# Altium project PCB_Libelula.PrjPcb
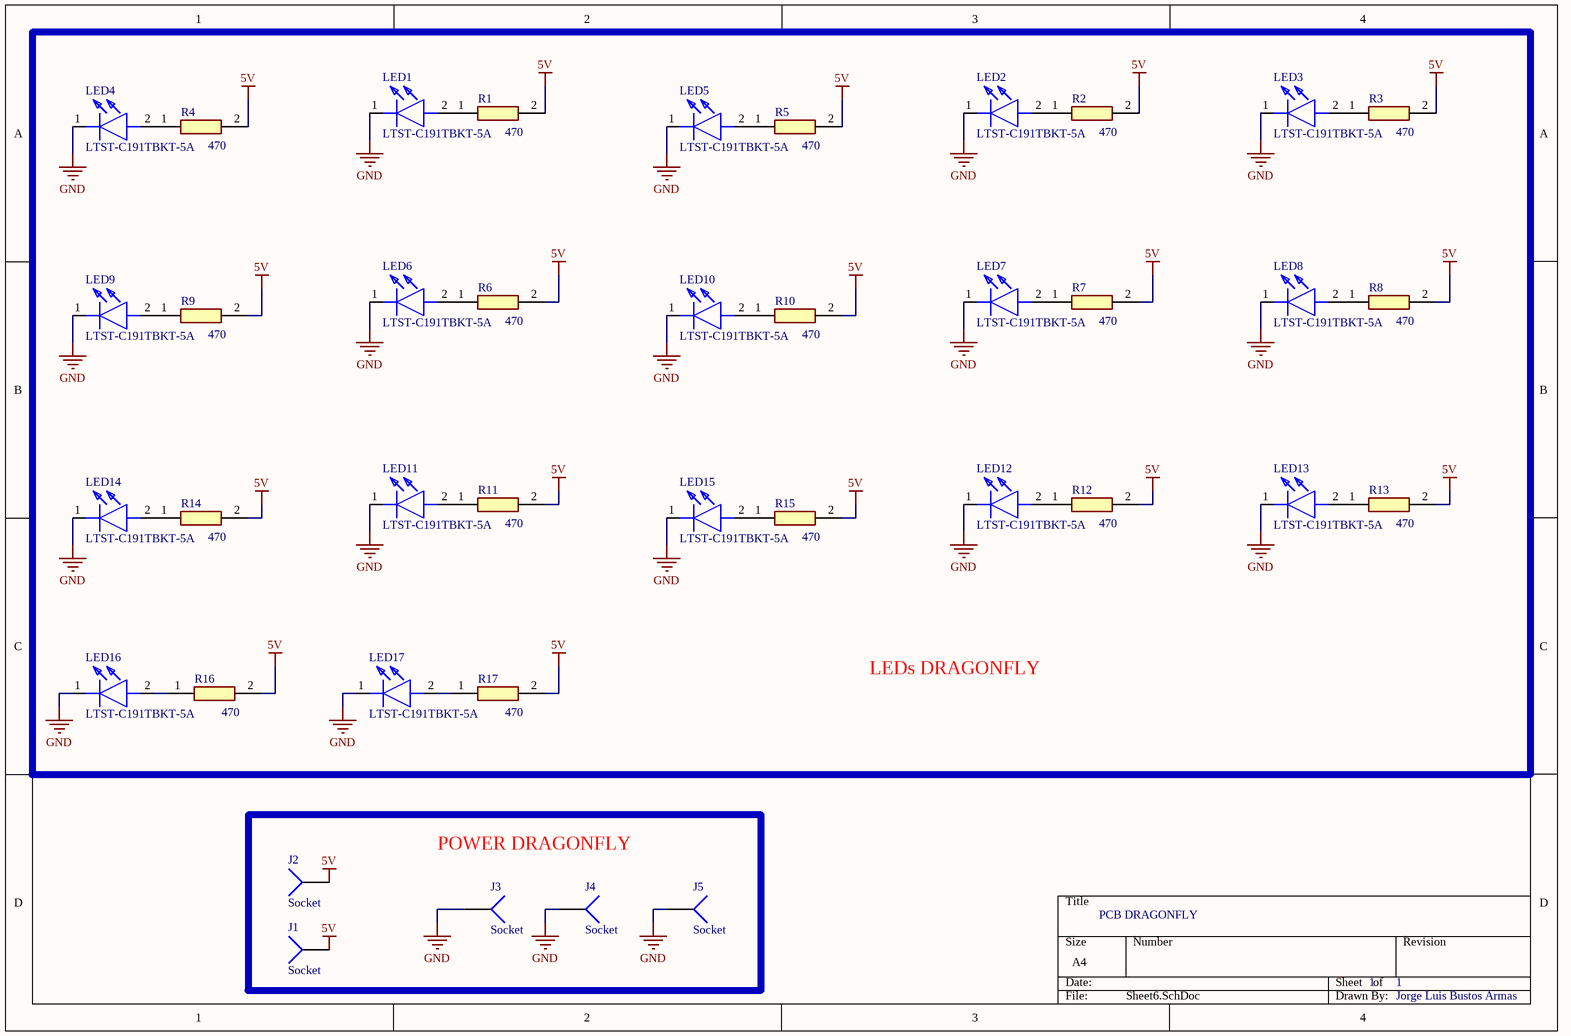
[diagram p0: Sheet6.SchDoc]
1 sheet, 39 parts. Net scope: global (net labels, ports and power ports of the same name join across sheets).
Board file: PCB6.PcbDoc

## Sheet Sheet6.SchDoc
size A4

### Parts
J1  Socket  [PIN1]  (no BOM)
J2  Socket  [PIN1]  (no BOM)
J3  Socket  [PIN1]  (no BOM)
J4  Socket  [PIN1]  (no BOM)
J5  Socket  [PIN1]  (no BOM)
LED1  LTST-C191TBKT-5A  [LEDC1608X60N]
LED2  LTST-C191TBKT-5A  [LEDC1608X60N]
LED3  LTST-C191TBKT-5A  [LEDC1608X60N]
LED4  LTST-C191TBKT-5A  [LEDC1608X60N]
LED5  LTST-C191TBKT-5A  [LEDC1608X60N]
LED6  LTST-C191TBKT-5A  [LEDC1608X60N]
LED7  LTST-C191TBKT-5A  [LEDC1608X60N]
LED8  LTST-C191TBKT-5A  [LEDC1608X60N]
LED9  LTST-C191TBKT-5A  [LEDC1608X60N]
LED10  LTST-C191TBKT-5A  [LEDC1608X60N]
LED11  LTST-C191TBKT-5A  [LEDC1608X60N]
LED12  LTST-C191TBKT-5A  [LEDC1608X60N]
LED13  LTST-C191TBKT-5A  [LEDC1608X60N]
LED14  LTST-C191TBKT-5A  [LEDC1608X60N]
LED15  LTST-C191TBKT-5A  [LEDC1608X60N]
LED16  LTST-C191TBKT-5A  [LEDC1608X60N]
LED17  LTST-C191TBKT-5A  [LEDC1608X60N]
R1  value 470  [RESC1608X55N]  (hidden comment: KTR03EZPF1501)
R2  value 470  [RESC1608X55N]  (hidden comment: KTR03EZPF1501)
R3  value 470  [RESC1608X55N]  (hidden comment: KTR03EZPF1501)
R4  value 470  [RESC1608X55N]  (hidden comment: KTR03EZPF1501)
R5  value 470  [RESC1608X55N]  (hidden comment: KTR03EZPF1501)
R6  value 470  [RESC1608X55N]  (hidden comment: KTR03EZPF1501)
R7  value 470  [RESC1608X55N]  (hidden comment: KTR03EZPF1501)
R8  value 470  [RESC1608X55N]  (hidden comment: KTR03EZPF1501)
R9  value 470  [RESC1608X55N]  (hidden comment: KTR03EZPF1501)
R10  value 470  [RESC1608X55N]  (hidden comment: KTR03EZPF1501)
R11  value 470  [RESC1608X55N]  (hidden comment: KTR03EZPF1501)
R12  value 470  [RESC1608X55N]  (hidden comment: KTR03EZPF1501)
R13  value 470  [RESC1608X55N]  (hidden comment: KTR03EZPF1501)
R14  value 470  [RESC1608X55N]  (hidden comment: KTR03EZPF1501)
R15  value 470  [RESC1608X55N]  (hidden comment: KTR03EZPF1501)
R16  value 470  [RESC1608X55N]  (hidden comment: KTR03EZPF1501)
R17  value 470  [RESC1608X55N]  (hidden comment: KTR03EZPF1501)

### Blocks framed on the sheet
LEDs DRAGONFLY: LED1-LED17 R1-R17
POWER DRAGONFLY: J1-J5

### Nets
5V: J1.1 J2.1 R1.2 R2.2 R3.2 R4.2 R5.2 R6.2 R7.2 R8.2 R9.2 R10.2 R11.2 R12.2 R13.2 R14.2 R15.2 R16.2 R17.2
GND: J3.1 J4.1 J5.1 LED1.1(K) LED2.1(K) LED3.1(K) LED4.1(K) LED5.1(K) LED6.1(K) LED7.1(K) LED8.1(K) LED9.1(K) LED10.1(K) LED11.1(K) LED12.1(K) LED13.1(K) LED14.1(K) LED15.1(K) LED16.1(K) LED17.1(K)
NetLED1_2: LED1.2(A) R1.1
NetLED2_2: LED2.2(A) R2.1
NetLED3_2: LED3.2(A) R3.1
NetLED4_2: LED4.2(A) R4.1
NetLED5_2: LED5.2(A) R5.1
NetLED6_2: LED6.2(A) R6.1
NetLED7_2: LED7.2(A) R7.1
NetLED8_2: LED8.2(A) R8.1
NetLED9_2: LED9.2(A) R9.1
NetLED10_2: LED10.2(A) R10.1
NetLED11_2: LED11.2(A) R11.1
NetLED12_2: LED12.2(A) R12.1
NetLED13_2: LED13.2(A) R13.1
NetLED14_2: LED14.2(A) R14.1
NetLED15_2: LED15.2(A) R15.1
NetLED16_2: LED16.2(A) R16.1
NetLED17_2: LED17.2(A) R17.1

### Notes on the sheet
- PCB DRAGONFLY
- 1
- Jorge Luis Bustos Armas

### Library data of the parts
LED1-LED17 = LTST-C191TBKT-5A: LED; Manufacturer_Name: Lite-On; Datasheet Link: http://www.mouser.com/ds/2/239/S_110_LTST-C191TBKT-5A-336399.pdf; Height: 0.65mm; Manufacturer_Part_Number: LTST-C191TBKT-5A; Mouser Part Number: 859-LTST-C191TBKT-5A; Mouser Price/Stock: https://www.mouser.co.uk/ProductDetail/Lite-On/LTST-C191TBKT-5A?qs=xb8aMrBSZRLgwF8AXHEbeQ%3D%3D; Arrow Part Number: LTST-C191TBKT-5A; Arrow Price/Stock: https://www.arrow.com/en/products/ltst-c191tbkt-5a/lite-on-technology?region=europe
R1-R17 = KTR03EZPF1501: Resistor 1.5K; Manufacturer_Name: ROHM Semiconductor; Datasheet Link: http://rohmfs.rohm.com/en/products/databook/datasheet/passive/resistor/chip_resistor/ktr.pdf; Height: 0.55mm; Manufacturer_Part_Number: KTR03EZPF1501; Mouser Part Number: 755-KTR03EZPF1501; Mouser Price/Stock: https://www.mouser.com/Search/Refine.aspx?Keyword=755-KTR03EZPF1501
J1-J5 = Socket: LatestRevisionDate: 17-Jul-2002; LatestRevisionNote: Re-released for DXP Platform.; Publisher: Altium Limited